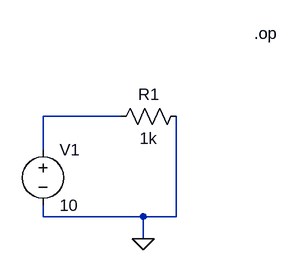
[diagram p0: schematic PreLab1.asc]
PreLab1.asc, the LTspice schematic file:
Version 4
SHEET 1 880 680
WIRE 224 64 112 64
WIRE 112 112 112 64
WIRE 112 208 112 192
WIRE 256 208 112 208
WIRE 304 208 304 64
WIRE 304 208 256 208
WIRE 256 240 256 208
FLAG 256 240 0
SYMBOL res 320 48 R90
WINDOW 0 0 56 VBottom 2
WINDOW 3 32 56 VTop 2
SYMATTR InstName R1
SYMATTR Value 1k
SYMBOL voltage 112 96 R0
SYMATTR InstName V1
SYMATTR Value 10
TEXT 416 -56 Left 2 !.op

The netlist it stands for:
* PreLab1.asc
R1 0 N001 1k
V1 N001 0 10
.op
.backanno
.end